# Altium schematic sheet Camera_Shield_Main.SchDoc: Block Diagram
size B; CompanyName: Cospan Design; DrawnBy: David McCoy; Engineer: David McCoy; Organization: Cospan Design; DocumentNumber: 1; Revision: .revision; SheetNumber: 1; SheetTotal: 4
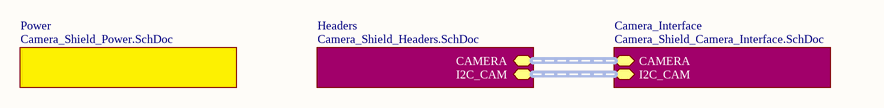
[diagram p0: Camera_Shield_Main.SchDoc]

## Sub-sheets
Camera_Interface = Camera_Shield_Camera_Interface.SchDoc: I2C_CAM (harness I2C_Harness), CAMERA (harness CAM_Harness)
Headers = Camera_Shield_Headers.SchDoc: I2C_CAM (harness I2C_Harness), CAMERA (harness CAM_Harness)
Power = Camera_Shield_Power.SchDoc: no entries

## Buses and harness runs
harness sheet Camera_Interface/CAMERA = sheet Headers/CAMERA
harness sheet Camera_Interface/I2C_CAM = sheet Headers/I2C_CAM

## Notes on the sheet
- Title:
- http://www.cospandesign.com
- Cospan Design
- Project:
- Document:
- Engineer:
- Drawn By:
- Approved By:
- Revision:
- Date:
- Number:
- of